# EAGLE design pickit2_clone (EAGLE 7.7.0)
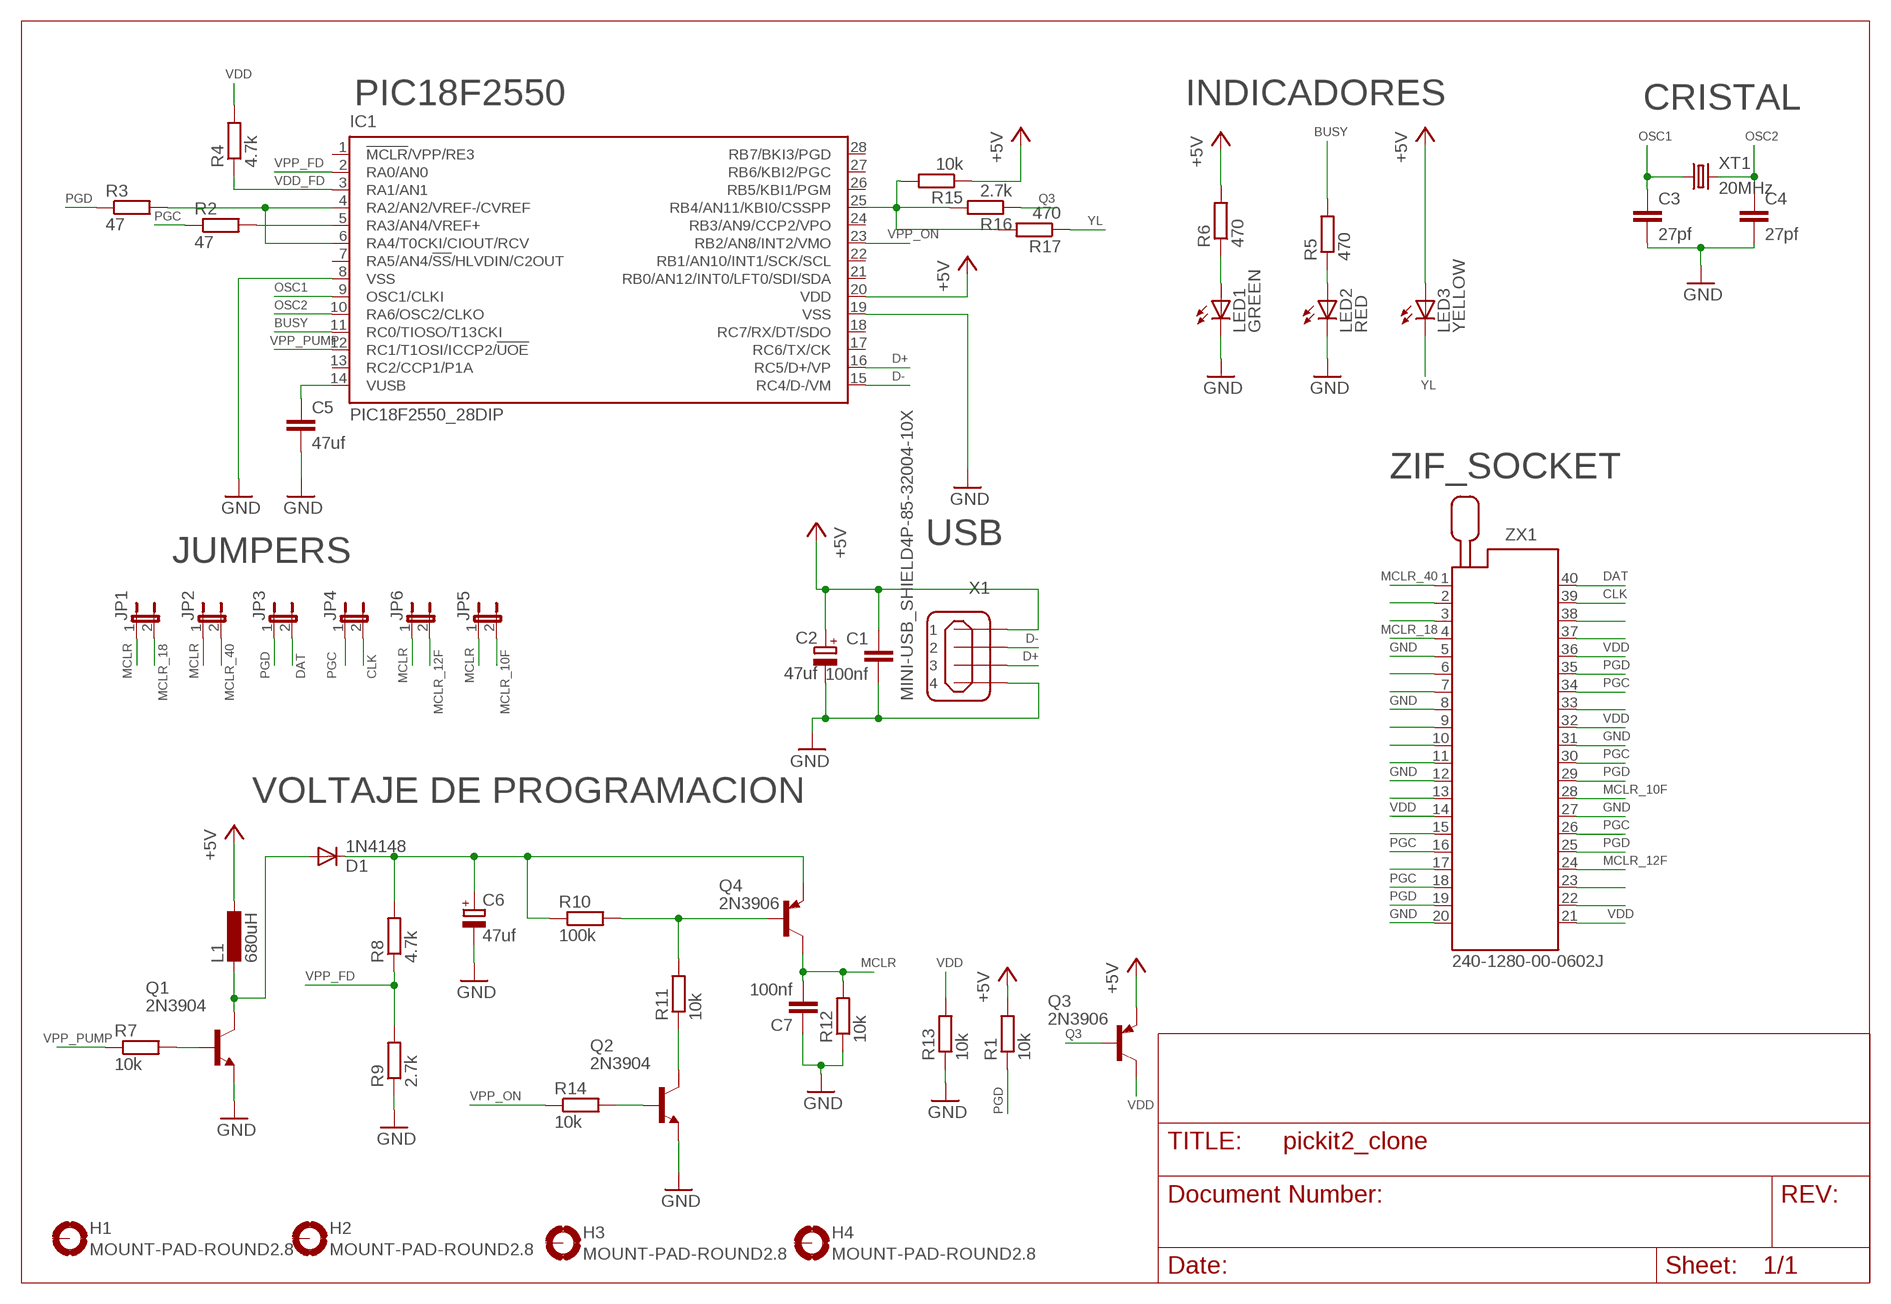
[diagram p0: schematic, sheet 1]

## Parts
C1  100nf  C-EU025-030X050  [C025-030X050]
C2  47uf  CPOL-EUE2-5  [E2-5]
C3  27pf  C-EU050-030X075  [C050-030X075]
C4  27pf  C-EU050-030X075  [C050-030X075]
C5  47uf  C-EU050-030X075  [C050-030X075]
C6  47uf  CPOL-EUE2-5  [E2-5]
C7  100nf  C-EU025-030X050  [C025-030X050]
D1  1N4148  [DO35-10]
H1  MOUNT-PAD-ROUND2.8  [2,8-PAD]
H2  MOUNT-PAD-ROUND2.8  [2,8-PAD]
H3  MOUNT-PAD-ROUND2.8  [2,8-PAD]
H4  MOUNT-PAD-ROUND2.8  [2,8-PAD]
IC1  PIC18F2550_28DIP  [DIL28-3]
JP1  JP1E  [JP1]
JP2  JP1E  [JP1]
JP3  JP1E  [JP1]
JP4  JP1E  [JP1]
JP5  JP1E  [JP1]
JP6  JP1E  [JP1]
L1  680uH  L-EU0207/10  [0207/10]
LED1  GREEN  LED5MM  [LED5MM]
LED2  RED  LED5MM  [LED5MM]
LED3  YELLOW  LED5MM  [LED5MM]
Q1  2N3904  BC447  [TO92-EBC]
Q2  2N3904  BC489  [TO92-EBC]
Q3  2N3906  2N4126  [TO92-CBE]
Q4  2N3906  2N4126  [TO92-CBE]
R1  10k  R-EU_0207/7  [0207/7]
R2  47  R-EU_0207/7  [0207/7]
R3  47  R-EU_0207/7  [0207/7]
R4  4.7k  R-EU_0207/7  [0207/7]
R5  470  R-EU_0207/7  [0207/7]
R6  470  R-EU_0207/7  [0207/7]
R7  10k  R-EU_0207/7  [0207/7]
R8  4.7k  R-EU_0207/7  [0207/7]
R9  2.7k  R-EU_0207/7  [0207/7]
R10  100k  R-EU_0207/7  [0207/7]
R11  10k  R-EU_0207/7  [0207/7]
R12  10k  R-EU_0207/7  [0207/7]
R13  10k  R-EU_0207/7  [0207/7]
R14  10k  R-EU_0207/7  [0207/7]
R15  10k  R-EU_0207/7  [0207/7]
R16  2.7k  R-EU_0207/7  [0207/7]
R17  470  R-EU_0207/7  [0207/7]
X1  MINI-USB_SHIELD4P-85-32004-10X  [85-32004-10X]
XT1  20MHz  CRYSTALHC49S  [HC49/S]
ZX1  240-1280-00-0602J  [240-1280-00-0602J]

## Nets
+5V: C1.1 C2.+ IC1.20(VDD) L1.1 LED3.A Q3.E R1.2 R6.2 R15.1 X1.1
BUSY: IC1.11(RC0/TIOSO/T13CKI) R5.2
CLK: JP4.2 ZX1.39
D+: IC1.16(RC5/D+/VP) X1.3
D-: IC1.15(RC4/D-/VM) X1.2
DAT: JP3.2 ZX1.40
GND: C1.2 C2.- C3.2 C4.2 C5.2 C6.- C7.1 IC1.8(VSS) IC1.19(VSS) LED1.K(C) LED2.K(C) Q1.E Q2.E R9.1 R12.1 R13.1 X1.4 ZX1.5 ZX1.8 ZX1.12 ZX1.20 ZX1.27 ZX1.31
MCLR: C7.2 JP1.1 JP2.1 JP5.1 JP6.1 Q4.C R12.2
MCLR_10F: JP5.2 ZX1.28
MCLR_12F: JP6.2 ZX1.24
MCLR_18: JP1.2 ZX1.4
MCLR_40: JP2.2 ZX1.1
N$1: C5.1 IC1.14(VUSB)
N$2: LED1.A R6.1
N$3: ZX1.2
N$4: IC1.4(RA2/AN2/VREF-/CVREF) IC1.6(RA4/T0CKI/CIOUT/RCV) R3.2
N$5: Q1.B R7.2
N$6: IC1.5(RA3/AN4/VREF+) R2.2
N$7: LED2.A R5.1
N$9: C6.+ D1.C Q4.E R8.2 R10.1
N$10: Q4.B R10.2 R11.2
N$11: IC1.25(RB4/AN11/KBI0/CSSPP) R15.2 R16.2 R17.2
N$15: Q2.C R11.1
N$16: Q2.B R14.2
N$17: ZX1.3
N$20: ZX1.6
N$21: ZX1.7
N$23: ZX1.9
N$24: ZX1.10
N$25: ZX1.11
N$26: ZX1.13
N$28: D1.A L1.2 Q1.C
N$29: ZX1.15
N$31: ZX1.17
N$36: ZX1.22
N$37: ZX1.23
N$45: ZX1.33
N$49: ZX1.37
N$50: ZX1.38
OSC1: C3.1 IC1.9(OSC1/CLKI) XT1.1
OSC2: C4.1 IC1.10(RA6/OSC2/CLKO) XT1.2
PGC: JP4.1 R2.1 ZX1.16 ZX1.18 ZX1.26 ZX1.30 ZX1.34
PGD: JP3.1 R1.1 R3.1 ZX1.19 ZX1.25 ZX1.29 ZX1.35
Q3: Q3.B R16.1
VDD: Q3.C R4.2 R13.2 ZX1.14 ZX1.21 ZX1.32 ZX1.36
VDD_FD: IC1.3(RA1/AN1) R4.1
VPP_FD: IC1.2(RA0/AN0) R8.1 R9.2
VPP_ON: IC1.23(RB2/AN8/INT2/VMO) R14.1
VPP_PUMP: IC1.12(RC1/T1OSI/ICCP2/!UOE) R7.1
YL: LED3.K(C) R17.1
Unconnected: H1.B2,8(MOUNT) H2.B2,8(MOUNT) H3.B2,8(MOUNT) H4.B2,8(MOUNT) IC1.1(!MCLR!/VPP/RE3) IC1.7(RA5/AN4/!SS!/HLVDIN/C2OUT) IC1.13(RC2/CCP1/P1A) IC1.17(RC6/TX/CK) IC1.18(RC7/RX/DT/SDO) IC1.21(RB0/AN12/INT0/LFT0/SDI/SDA) IC1.22(RB1/AN10/INT1/SCK/SCL) IC1.24(RB3/AN9/CCP2/VPO) IC1.26(RB5/KBI1/PGM) IC1.27(RB6/KBI2/PGC) IC1.28(RB7/BKI3/PGD) X1.M1(S1) X1.M2(S2)

## Notes on the sheet
- PIC18F2550 | INDICADORES | CRISTAL
- ZIF_SOCKET
- USB
- JUMPERS
- VOLTAJE DE PROGRAMACION

## Library data of the parts
C1 C3-C5 C7 = rcl:C-EU: CAPACITOR, European symbol
C2 C6 = rcl:CPOL-EU: POLARIZED CAPACITOR, European symbol
D1 = diode:1N4148: DIODE high speed (Philips)
H1-H4 = holes:MOUNT-PAD-ROUND: MOUNTING PAD, round
IC1 = microchip:PIC18F2*_28: USB Microcontrollers with nanoWatt Technology High-Performance, Enhanced Flash, 28/40/44-Pin, Source: http://ww1.microchip.com/downloads/en/devicedoc/39632c.pdf
JP1-JP6 = jumper:JP1E: JUMPER
L1 = rcl:L-EU: INDUCTOR, European symbol
LED1-LED3 = led:LED: LED OSRAM: - CHIPLED LG R971, LG N971, LY N971, LG Q971, LY Q971, LO R971, LY R971 LH N974, LH R974 LS Q976, LO Q976, LY Q976 LO Q996 - Hyper CHIPLED LW Q18S LB Q993, LB Q99A, LB R99A - SideLED LS A670, LO A670, LY A670, LG A670, LP A670 LB A673, LV A673, LT A673, LW A673 LH A674 LY A675 LS A676, LA A676, LO A676, LY A676, LW A676 LS A679, LY A679, LG A679 - Hyper Micro SIDELED® LS Y876, LA Y876, LO Y876, LY Y876 LT Y87S - SmartLED LW L88C, LW L88S LB L89C, LB L89S, LG L890 LS L89K, LO L89K, LY L89K LS L896, LA L896, LO L896, LY L896 - TOPLED LS T670, LO T670, LY T670, LG T670, LP T670 LSG T670, LSP T670, LSY T670, LOP T670, LYG T670 LG T671, LOG T671, LSG T671 LB T673, LV T673, LT T673, LW T673 LH T674 LS T676, LA T676, LO T676, LY T676, LB T676, LH T676, LSB T676, LW T676 LB T67C, LV T67C, LT T67C, LS T67K, LO T67K, LY T67K, LW E67C LS E67B, LA E67B, LO E67B, LY E67B, LB E67C, LV E67C, LT E67C LW T67C LS T679, LY T679, LG T679 LS T770, LO T770, LY T770, LG T770, LP T770 LB T773, LV T773, LT T773, LW T773 LH T774 LS E675, LA E675, LY E675, LS T675 LS T776, LA T776, LO T776, LY T776, LB T776 LHGB T686 LT T68C, LB T68C - Hyper Mini TOPLED® LB M676 - Mini TOPLED Santana® LG M470 LS M47K, LO M47K, LY M47K Source: http://www.osram.convergy.de - LUMILED® LXK2-PW12-R00, LXK2-PW12-S00, LXK2-PW14-U00, LXK2-PW14-V00 LXK2-PM12-R00, LXK2-PM12-S00, LXK2-PM14-U00 LXK2-PE12-Q00, LXK2-PE12-R00, LXK2-PE12-S00, LXK2-PE14-T00, LXK2-PE14-U00 LXK2-PB12-K00, LXK2-PB12-L00, LXK2-PB12-M00, LXK2-PB14-N00, LXK2-PB14-P00, LXK2-PB14-Q00 LXK2-PR12-L00, LXK2-PR12-M00, LXK2-PR14-Q00, LXK2-PR14-R00 LXK2-PD12-Q00, LXK2-PD12-R00, LXK2-PD12-S00 LXK2-PH12-R00, LXK2-PH12-S00 LXK2-PL12-P00, LXK2-PL12-Q00, LXK2-PL12-R00 Source: www.luxeon.com
Q1 = transistor-npn:BC447*: NPN Transistor
Q2 = transistor-npn:BC489*: NPN Transistor
Q3 Q4 = transistor-pnp:2N4126*: PNP Transistror
R1-R17 = rcl:R-EU_: RESISTOR, European symbol
X1 = con-cypressindustries:MINI-USB_SHIELD4P-: MINI USB 4 Pol. Source: www.cypressindustries.com
XT1 = crystal:CRYSTAL: CRYSTAL
ZX1 = con-3m:240-?-00-0602J: Zero Insertion Force Socked Source: http://www.3M.com/ehpd

## Board
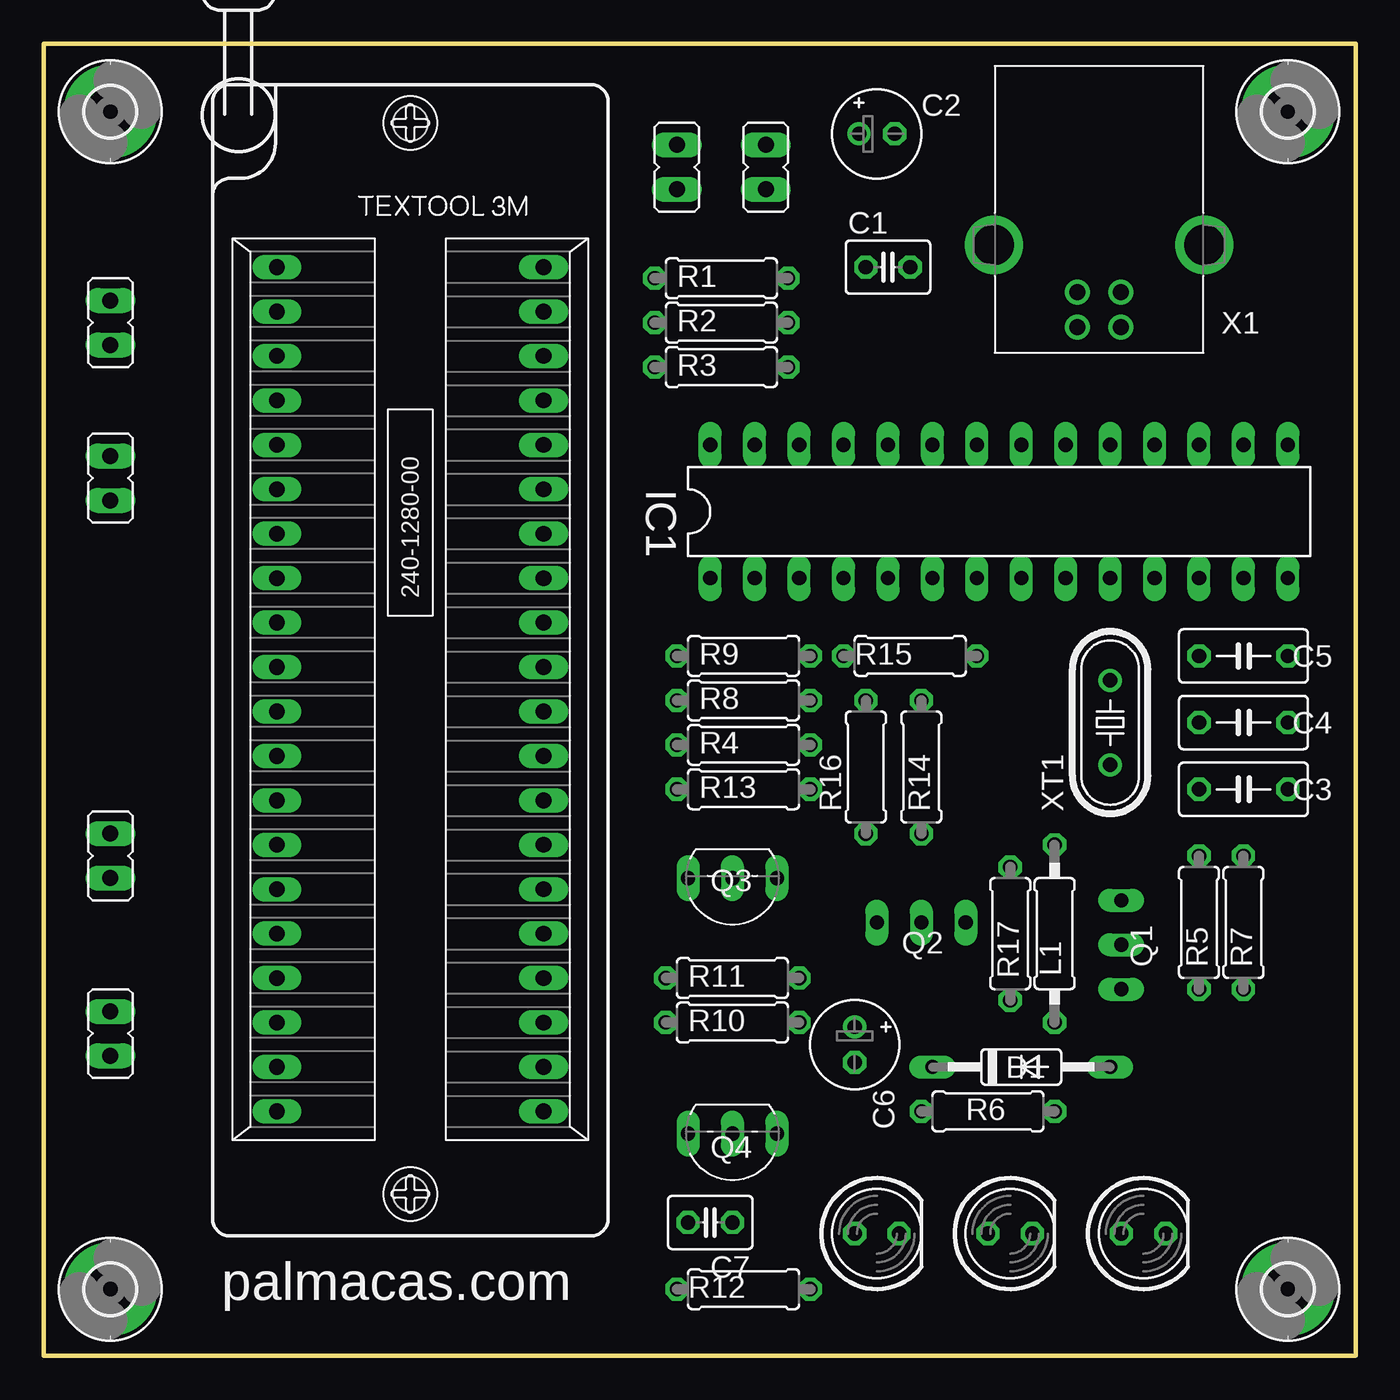
[diagram p1: board, top side]
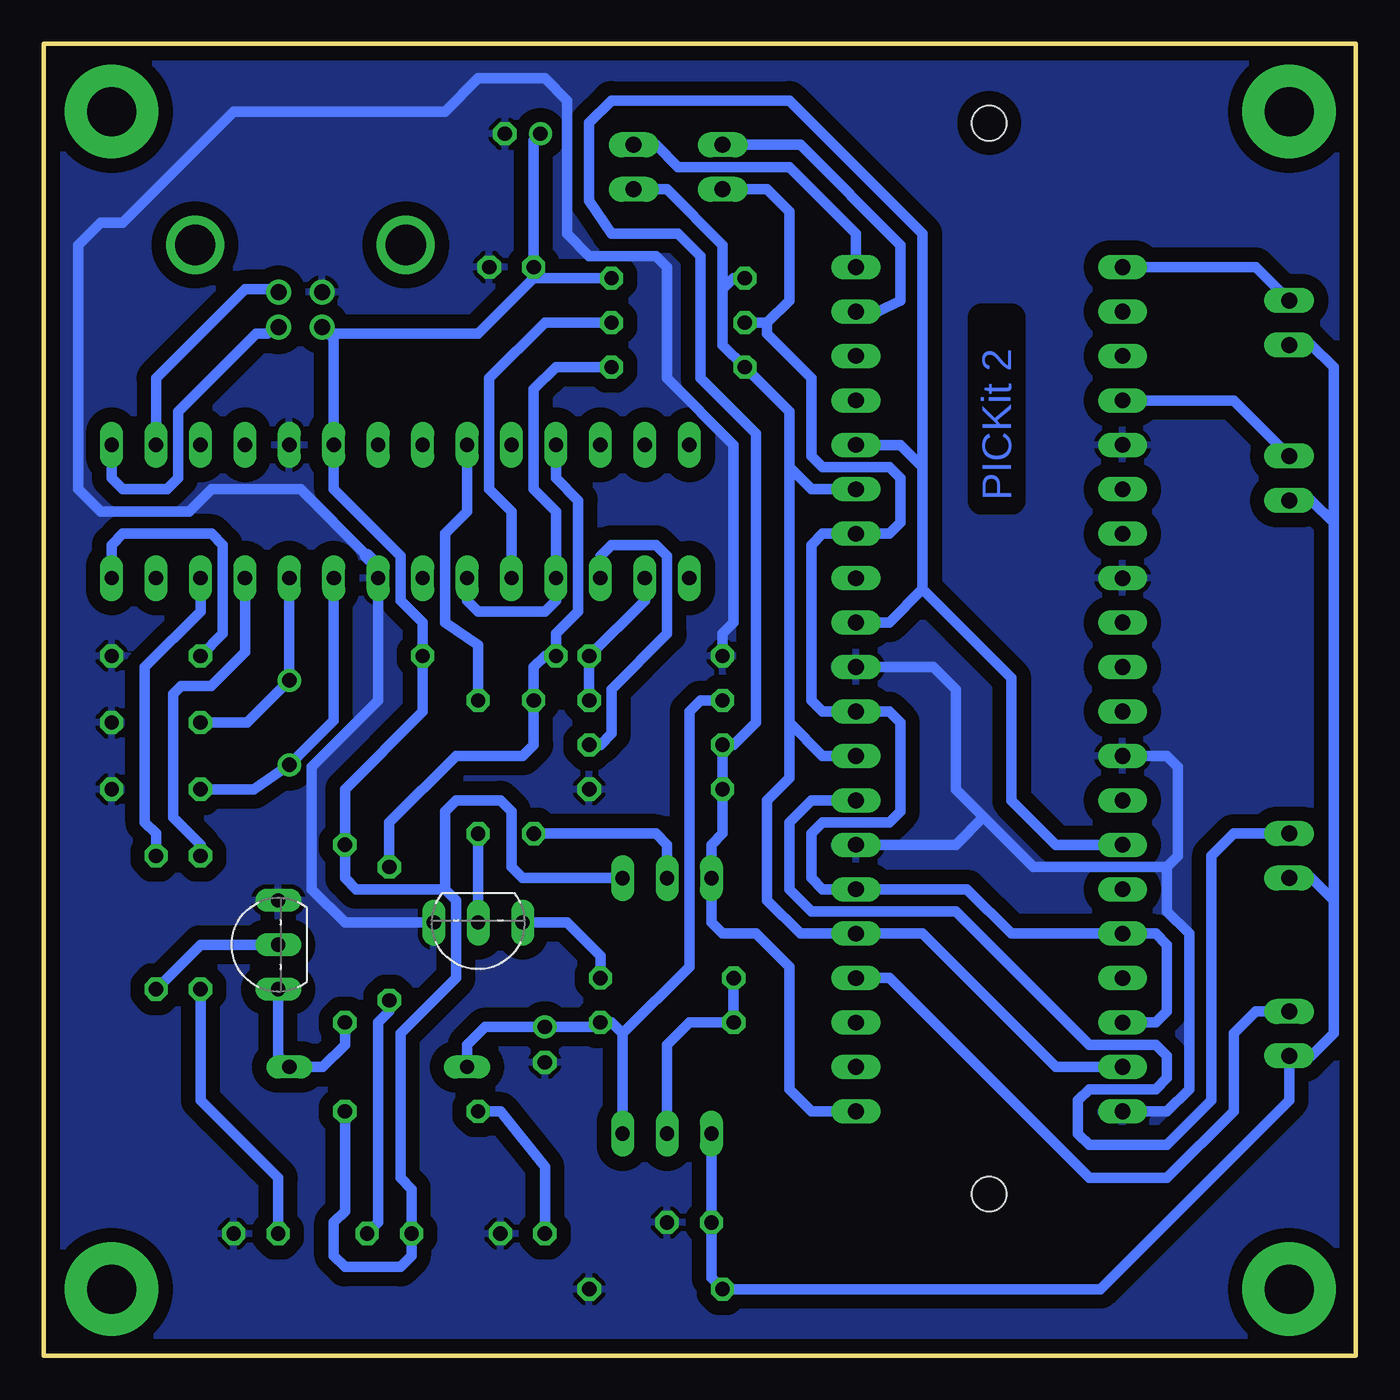
[diagram p2: board, bottom side, seen from below]

Size 75 x 75 mm. Coordinates in mm from the lower left corner, seen from the top.
Outline: 0,0 75,0 75,75 0,75 0,0
Copper layers (1*16): Top 0.035mm / dielectric 1.5mm / Bottom 0.035mm
Design rules "default": minimum track width 6mil, minimum drill 12mil, track to track 6mil, track to pad 6mil, pad to pad 6mil, via to via 6mil, smd to smd 0mil, copper to edge 10mil, drill to drill 10mil, minimum pad ring 10mil, minimum via ring 6mil, stop-mask expansion 2mil, vias tented up to drill 100mil, thermal gap 10mil

### Footprints (pad centres in the part's own frame; a part is rotated, then mirrored left to right if it is on the bottom)
C025-030X050 = drill 0.813 octagon: 1 -1.27,0; 2 1.27,0
E2-5 = drill 0.813 pad 1.27: + -1.016,0 | drill 0.813 pad 1.27 octagon: - 1.016,0
C050-030X075 = drill 0.813 octagon: 1 -2.54,0; 2 2.54,0
DO35-10 = drill 0.813 long: A 5.08,0; C -5.08,0
2,8-PAD = drill 2.8 pad 5.334: B2,8 0,0
DIL28-3 = drill 0.813 long: 1 -16.51,-3.81; 2 -13.97,-3.81; 3 -11.43,-3.81; 4 -8.89,-3.81; 5 -6.35,-3.81; 6 -3.81,-3.81; 7 -1.27,-3.81; 8 1.27,-3.81; 9 3.81,-3.81; 10 6.35,-3.81; 11 8.89,-3.81; 12 11.43,-3.81; 13 13.97,-3.81; 14 16.51,-3.81; 15 16.51,3.81; 16 13.97,3.81; 17 11.43,3.81; 18 8.89,3.81; 19 6.35,3.81; 20 3.81,3.81; 21 1.27,3.81; 22 -1.27,3.81; 23 -3.81,3.81; 24 -6.35,3.81; 25 -8.89,3.81; 26 -11.43,3.81; 27 -13.97,3.81; 28 -16.51,3.81
JP1 = drill 0.914 long: 1 0,-1.27; 2 0,1.27
0207/10 = drill 0.813 octagon: 1 -5.08,0; 2 5.08,0
LED5MM = drill 0.813 octagon: A -1.27,0; K 1.27,0
TO92-EBC = drill 0.813 long: B 0,-1.27; C -2.54,-1.27; E 2.54,-1.27
TO92-CBE = drill 0.813 long: B 0,0; C 2.54,0; E -2.54,0
0207/7 = drill 0.813 octagon: 1 -3.81,0; 2 3.81,0
85-32004-10X = drill 0.92 pad 1.27: 1 4.71,-1.25; 2 4.71,1.25; 3 2.71,1.25; 4 2.71,-1.25 | drill 2.3 pad 3: M1 0,6.02; M2 0,-6.02
HC49/S = drill 0.813: 1 -2.413,0; 2 2.413,0
240-1280-00-0602J = drill 0.9 long: 1 -24.13,-7.62; 2 -21.59,-7.62; 3 -19.05,-7.62; 4 -16.51,-7.62; 5 -13.97,-7.62; 6 -11.43,-7.62; 7 -8.89,-7.62; 8 -6.35,-7.62; 9 -3.81,-7.62; 10 -1.27,-7.62; 11 1.27,-7.62; 12 3.81,-7.62; 13 6.35,-7.62; 14 8.89,-7.62; 15 11.43,-7.62; 16 13.97,-7.62; 17 16.51,-7.62; 18 19.05,-7.62; 19 21.59,-7.62; 20 24.13,-7.62; 21 24.13,7.62; 22 21.59,7.62; 23 19.05,7.62; 24 16.51,7.62; 25 13.97,7.62; 26 11.43,7.62; 27 8.89,7.62; 28 6.35,7.62; 29 3.81,7.62; 30 1.27,7.62; 31 -1.27,7.62; 32 -3.81,7.62; 33 -6.35,7.62; 34 -8.89,7.62; 35 -11.43,7.62; 36 -13.97,7.62; 37 -16.51,7.62; 38 -19.05,7.62; 39 -21.59,7.62; 40 -24.13,7.62 | hole 2: 28.86,0; -32.36,0

### Placement (x,y rotation side)
C1  48.26,62.23 0 top
C2  47.62,69.85 0 top
C3  68.58,32.38 0 top
C4  68.58,36.2 0 top
C5  68.58,40.01 0 top
C6  46.35,17.78 270 top
C7  38.1,7.62 180 top
D1  55.88,16.51 0 top
H1  3.81,3.81 0 top
H2  71.12,3.81 0 top
H3  3.81,71.12 0 top
H4  71.12,71.12 0 top
IC1  54.61,48.26 0 top
JP1  3.81,50.16 0 top
JP2  3.81,59.05 0 top
JP3  41.27,67.94 0 top
JP4  36.2,67.94 0 top
JP5  3.81,28.57 0 top
JP6  3.81,18.41 0 top
L1  57.78,24.13 270 top
LED1  47.62,6.99 0 top
LED2  62.87,6.99 0 top
LED3  55.24,6.99 0 top
Q1  62.87,23.5 90 bottom
Q2  50.16,23.5 180 bottom
Q3  39.37,27.3 180 top
Q4  39.37,12.7 180 top
R1  38.73,61.59 0 top
R2  38.73,59.05 0 top
R3  38.73,56.52 0 top
R4  40.01,34.92 180 top
R5  66.04,24.77 90 top
R6  53.98,13.97 0 top
R7  68.58,24.77 270 top
R8  40.01,37.47 180 top
R9  40.01,40.01 0 top
R10  39.37,19.05 180 top
R11  39.37,21.59 180 top
R12  40.01,3.81 180 top
R13  40.01,32.38 180 top
R14  50.16,33.66 270 top
R15  49.53,40.01 180 top
R16  46.99,33.66 90 top
R17  55.24,24.13 90 top
X1  60.33,63.5 270 top
XT1  60.96,36.2 90 top
ZX1  20.95,38.1 270 top

### Tracks (layer width: path | path; a pad name or v marks a point on that pad's centre or on a via)
+5V
  Bottom 0.61: 46.99,61.59 50.16,58.42 58.7,58.42 X1.1 58.42,58.13 IC1.20 58.42,49.53 54.61,45.72 54.61,43.18 53.34,41.91 R15.1 53.34,36.83 57.78,32.38 L1.1 57.78,27.3 57.15,26.67 52.07,26.67 | 46.99,61.59 C1.1 46.99,69.47 C2.+ | 46.99,61.59 R1.2 | 52.07,26.67 51.44,26.04 51.44,21.59 54.61,18.41 54.61,10.16 53.98,9.53 LED3.A 53.98,5.71 54.61,5.08 57.78,5.08 58.42,5.71 58.42,7.62 57.78,8.26 R6.2 | Q3.E 47.62,27.3 48.26,27.94 48.26,31.11 48.9,31.75 51.44,31.75 52.07,31.11 52.07,26.67
BUSY
  Bottom 0.61: IC1.11 63.5,40.22 65.43,38.29 67.14,38.29 67.61,37.82 67.61,30.78 66.04,29.21 R5.2
CLK
  Bottom 0.61: JP4.2 31.75,69.22 26.04,63.5 26.04,60.33 27.3,59.69 ZX1.39
D+
  Bottom 0.406: X1.3 61.77,60.79
  Bottom 0.61: 61.77,60.79 61.94,60.96 63.5,60.96 68.58,55.88 IC1.16
D-
  Bottom 0.406: 61.86,58.79 X1.2
  Bottom 0.61: 61.86,58.79 62.23,58.42 62.87,58.42 67.31,53.98 67.31,50.16 67.94,49.53 70.48,49.53 71.12,50.16 IC1.15
DAT
  Bottom 0.61: JP3.2 40.01,69.22 38.73,67.94 32.38,67.94 28.57,64.14 ZX1.40
GND
  Bottom 0.61: 56.52,45.72 60.33,49.53 65.41,49.53 66.67,48.26 71.75,48.26 73.03,49.53 73.03,63.5 71.75,64.77 70.48,64.77 64.14,71.12 52.07,71.12 50.16,73.03 46.35,73.03 45.09,71.75 45.09,64.14 43.81,62.87 40.01,62.87 39.37,62.23 39.37,55.88 35.56,52.07 35.56,41.91 36.2,41.27 R9.1 | ZX1.31 24.13,39.37 22.86,38.1 22.86,32.38 21.27,30.8 | 21.27,30.8 18.41,27.94 10.79,27.94 | 10.79,27.94 10.16,28.57 10.16,33.66 10.79,34.29 ZX1.12 | Q2.E 57.78,24.77 59.69,26.67 59.69,33.66 55.88,37.47 IC1.8 | ZX1.27 22.86,29.21 21.27,30.8 | 10.79,27.94 10.79,25.4 9.53,24.13 9.53,15.24 10.79,13.97 ZX1.20
  Bottom 0.813: IC1.8 55.88,45.09 56.52,45.72
  pour Bottom (isolate 0.813): -0.11,75.09 74.93,75.09 74.93,0 0,0 0,74.93
MCLR
  Bottom 0.61: JP1.1 2.54,48.9 1.27,47.62 | 1.27,47.62 1.27,56.52 2.54,57.78 JP2.1 | 1.27,26.04 1.27,18.41 2.54,17.14 JP6.1 3.81,14.61 14.61,3.81 R12.2 36.83,4.45 C7.2 Q4.C | 1.27,26.04 1.27,47.62 | JP5.1 2.54,27.3 1.27,26.04
MCLR_10F
  Bottom 0.61: ZX1.28 31.11,31.75 32.38,30.48 32.38,26.67 31.11,25.4 22.86,25.4 15.24,17.78 11.43,17.78 10.79,17.14 10.79,15.88 11.43,15.24 15.24,15.24 15.88,14.61 15.88,12.7 15.24,12.06 10.79,12.06 8.26,14.61 8.26,28.57 6.99,29.84 JP5.2
MCLR_12F
  Bottom 0.61: JP6.2 5.71,19.68 6.99,18.41 6.99,13.97 10.79,10.16 15.24,10.16 26.67,21.59 ZX1.24
MCLR_18
  Bottom 0.61: JP1.2 6.99,54.61 ZX1.4 13.97,54.61
MCLR_40
  Bottom 0.61: JP2.2 5.71,62.23 ZX1.1
N$1
  Bottom 0.61: IC1.14 71.12,46.35 70.48,46.99 65.41,46.99 64.77,46.35 64.77,41.27 C5.1
N$2
  Bottom 0.61: LED1.A 46.35,10.79 48.9,13.97 R6.1
N$4
  Bottom 0.61: IC1.6 50.8,43.18 50.16,42.55 46.35,42.55 45.72,43.18 IC1.4 45.72,48.26 46.99,49.53 46.99,55.24 45.72,56.52 R3.2
N$5
  Bottom 0.61: Q1.B 66.04,23.5 R7.2
N$6
  Bottom 0.61: IC1.5 48.26,48.26 49.53,49.53 49.53,55.88 46.35,59.05 R2.2
N$7
  Bottom 0.61: LED2.A 61.59,10.16 66.04,14.61 R5.1
N$9
  Bottom 0.61: D1.C 50.8,17.78 49.78,18.8 C6.+ 43.43,18.8 R10.1 42.55,19.05 41.91,18.41 | 41.91,18.41 38.1,22.23 38.1,36.83 37.47,37.47 R8.2 | Q4.E 41.91,18.41
N$10
  Bottom 0.61: R11.2 R10.2 38.1,19.05 39.37,17.78 Q4.B
N$11
  Bottom 0.61: IC1.25 45.72,50.16 44.45,48.9 44.45,42.55 45.72,41.27 R15.2 46.35,40.01 46.99,39.37 R16.2 46.99,34.92 47.62,34.29 51.44,34.29 55.24,30.48 R17.2
N$15
  Bottom 0.61: R11.1 43.18,22.86 45.09,24.77 Q2.C
N$16
  Bottom 0.61: Q2.B R14.2
N$28
  Bottom 0.61: Q1.C 61.59,17.14 D1.A 59.05,16.51 57.78,17.78 L1.2
OSC1
  Bottom 0.61: IC1.9 58.42,36.32 XT1.1 62.99,32.38 C3.1
OSC2
  Bottom 0.61: IC1.10 XT1.2 63.37,36.2 C4.1
PGC
  Bottom 0.61: 33.66,59.05 R2.1 | 33.66,59.05 32.38,60.33 32.38,65.41 33.66,66.67 JP4.1 | 33.66,59.05 33.66,58.42 31.11,55.88 31.11,51.44 30.48,50.8 26.67,50.8 26.04,50.16 26.04,47.62 26.67,46.99 ZX1.34 30.48,46.99 31.11,46.35 31.11,37.47 30.48,36.83 ZX1.30 26.67,36.83 26.04,36.2 26.04,31.11 26.67,30.48 30.48,30.48 31.11,29.84 31.11,27.3 30.48,26.67 ZX1.26 22.23,26.67 19.68,24.13 ZX1.16 11.43,24.13 10.79,23.5 10.79,19.68 11.43,19.05 ZX1.18
PGD
  Bottom 0.61: 36.2,60.96 36.2,57.78 R3.1 32.38,53.98 32.38,50.8 | R1.1 35.56,61.59 36.2,60.96 | 36.2,60.96 36.2,63.5 39.37,66.67 JP3.1 | 32.38,50.8 31.11,49.53 ZX1.35 | ZX1.29 30.48,34.29 32.38,36.2 | 32.38,36.2 32.38,50.8 | ZX1.19 17.14,16.51 24.77,24.13 ZX1.25 31.75,24.13 33.66,26.04 33.66,31.75 32.38,33.02 32.38,36.2
Q3
  Bottom 0.61: R16.1 40.01,29.84 39.37,29.21 Q3.B
VDD
  Bottom 0.61: ZX1.14 17.14,29.21 19.68,31.75 19.68,38.73 24.77,43.81 | 24.77,43.81 26.67,41.91 ZX1.32 | 24.77,50.8 24.77,43.81 | ZX1.21 31.11,13.97 32.38,15.24 32.38,22.23 34.29,24.13 36.2,24.13 36.83,24.77 Q3.C 36.83,29.21 36.2,29.84 R13.2 R4.2 35.56,34.92 34.29,36.2 34.29,52.7 37.47,55.88 37.47,62.87 38.73,64.14 42.55,64.14 43.81,66.04 43.81,70.48 42.55,71.75 32.38,71.75 24.77,64.14 24.77,50.8 | ZX1.36 26.04,52.07 24.77,50.8
VDD_FD
  Bottom 0.61: IC1.3 43.18,45.72 42.55,46.35 40.01,46.35 39.37,45.72 39.37,41.27 42.55,38.1 42.55,35.56 43.18,34.92 R4.1
VPP_FD
  Bottom 0.61: R8.1 R9.2 40.64,43.18 IC1.2
VPP_ON
  Bottom 0.61: IC1.23 50.8,48.26 52.07,46.99 52.07,41.91 50.16,40.64 R14.1
VPP_PUMP
  Bottom 0.61: R7.1 68.58,29.84 69.22,30.48 69.22,39.37 66.04,42.55 IC1.12
YL
  Bottom 0.61: R17.1 55.24,19.68 55.88,19.05 55.88,7.62 LED3.K

### Text on the board
Bottom: PICKit 2
tPlace: palmacas.com
Document: CLK | DAT | 28,40 | 18 | MEM | 10F | 12F | PICKit 2 | USB | TARGET | BUSY